# EAGLE design display_reva (EAGLE 7.7.0)
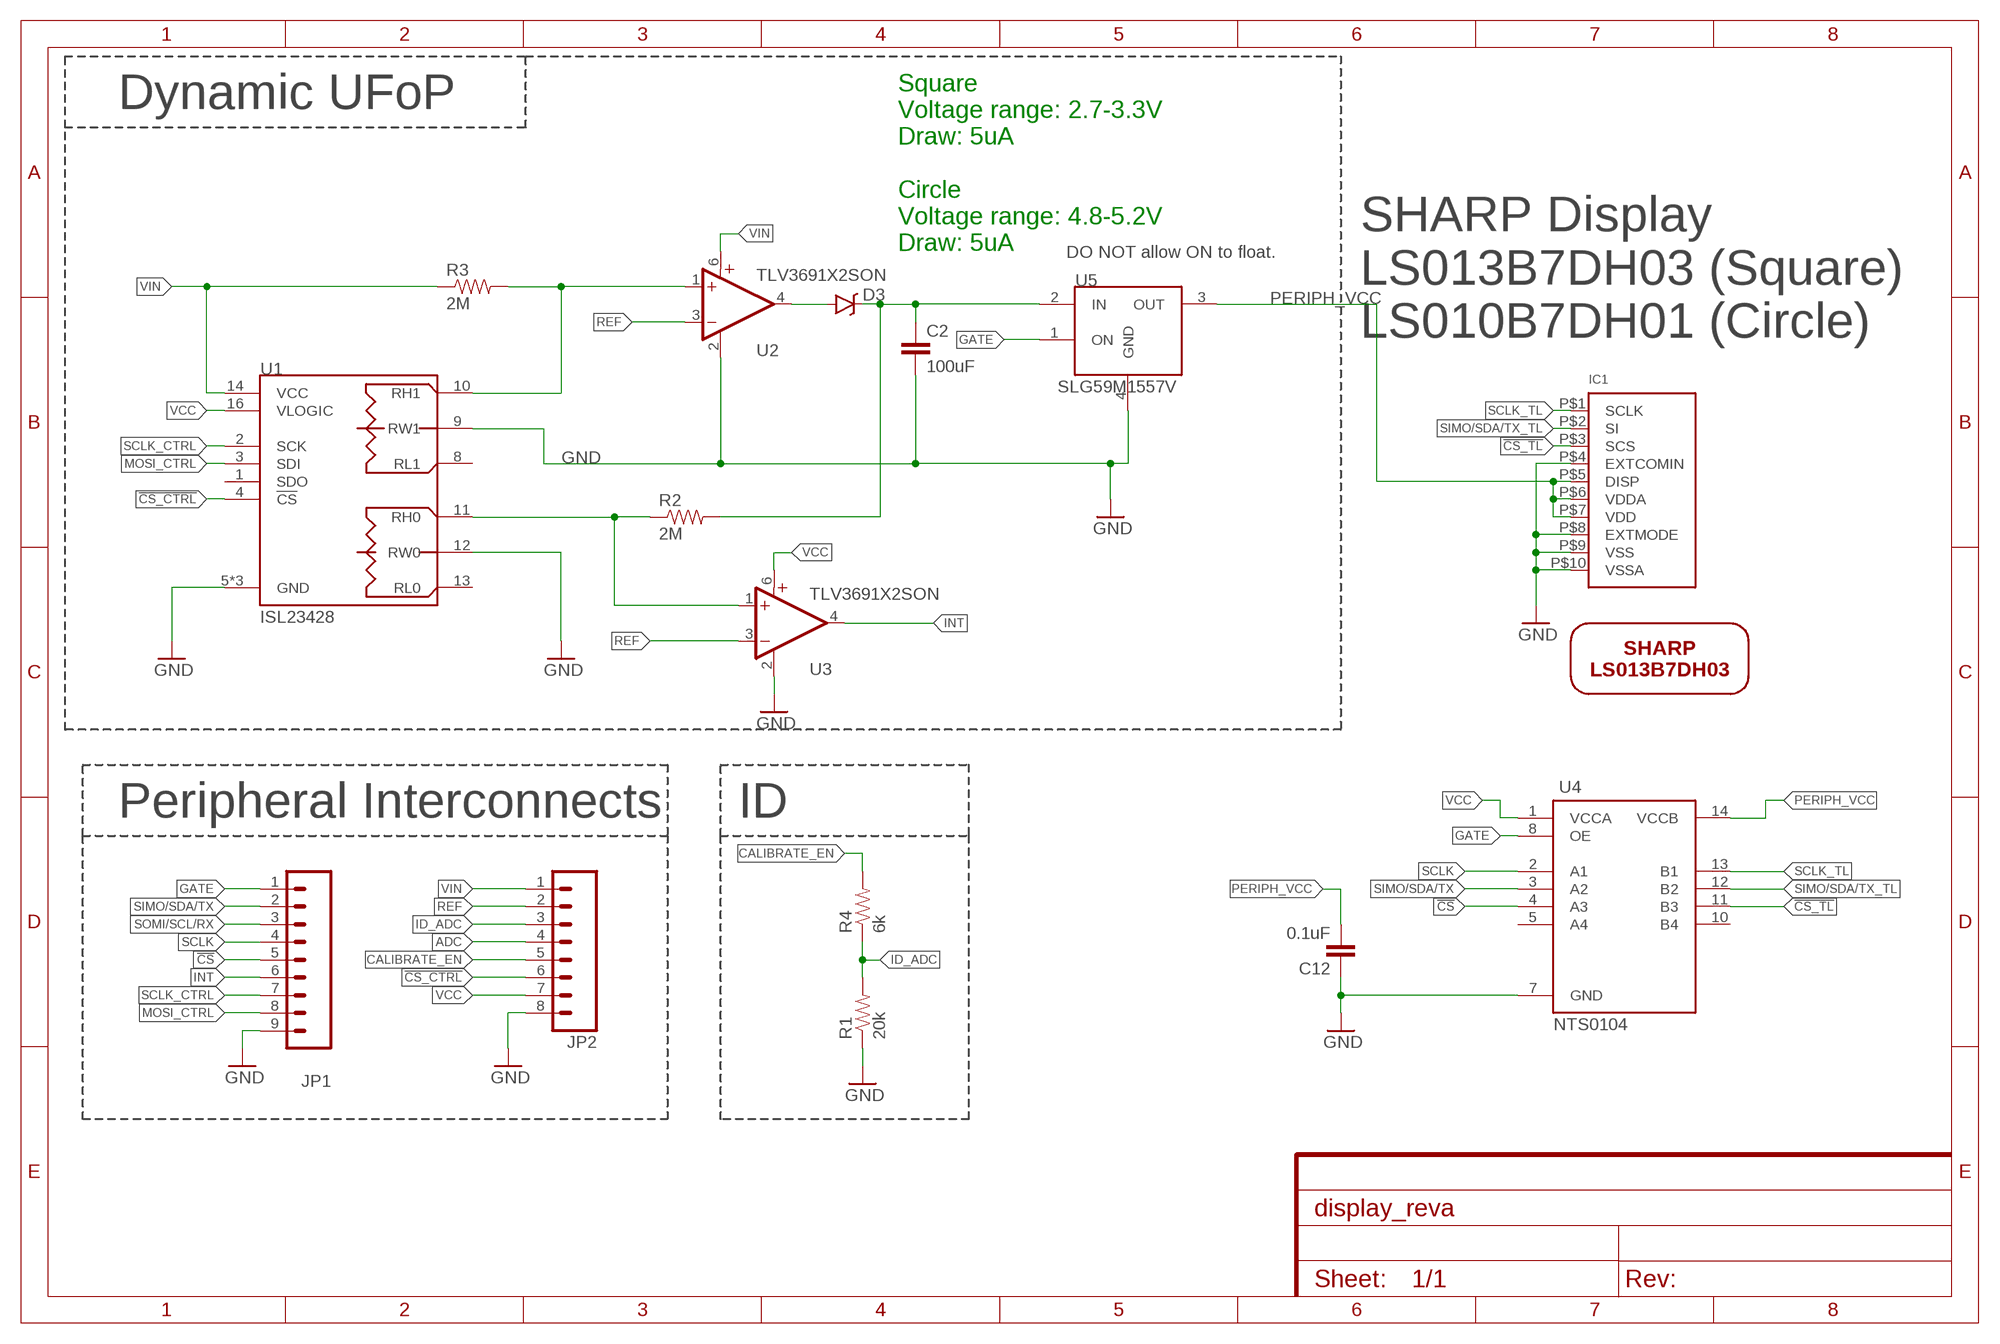
[diagram p0: schematic, sheet 1]
FRAME2 (FRAME-A4L): CNAME: Display Peripheral; CREVISION: A; DESIGNER: Josiah Hester

## Parts
C2  100uF  CAP1206  [1206]
C12  0.1uF  C-EU  [0402]
D3  RB751  DIODE-SCHOTTKY-RB751  [SOD-523]
IC1  SHARP_MEMORYLCD_10PIN  [FPC_10PIN_52892-1095]
JP1  M091.27MM  [1X09-1.27MM]
JP2  M081.27MM  [1X08-1.27MM]
R1  20k  R-EU  [0402]
R2  2M  R-EU  [0402]
R3  2M  R-EU  [0402]
R4  6k  R-EU  [0402]
U1  ISL23428  [UTQFN-16]
U2  TLV3691X2SON  [X2SON]
U3  TLV3691X2SON  [X2SON]
U4  NTS0104  [TSSOP14]
U5  SLG59M1557V  [4STDFN]
U$3  LS013B7DH03  [LS013B7DH03_HF]

## Nets
!CS: JP1.5 U4.4(A3)
!CS_CTRL: JP2.6 U1.4(!CS)
!CS_TL: IC1.P$3(SCS) U4.11(B3)
ADC: JP2.4
CALIBRATE_EN: JP2.5 R4.2
GATE: JP1.1 U4.8(OE) U5.1(ON)
GND: C2.2 C12.1 IC1.P$4(EXTCOMIN) IC1.P$8(EXTMODE) IC1.P$9(VSS) IC1.P$10(VSSA) JP1.9 JP2.8 R1.1 U1.5(GND) U1.6(GND) U1.9(RW1) U1.12(RW0) U1.15(GND) U2.2(GND) U3.2(GND) U4.7(GND) U5.4(GND)
ID_ADC: JP2.3 R1.2 R4.1
INT: JP1.6 U3.4(OUT)
MOSI_CTRL: JP1.8 U1.3(SDI)
N$1: D3.A U2.4(OUT)
N$2: C2.1 D3.C R2.2 U5.2(IN)
N$4: R3.2 U1.10(RH1) U2.1(+IN)
N$5: R2.1 U1.11(RH0) U3.1(+IN)
PERIPH_VCC: C12.2 IC1.P$5(DISP) IC1.P$6(VDDA) IC1.P$7(VDD) U4.14(VCCB) U5.3(OUT)
REF: JP2.2 U2.3(-IN) U3.3(-IN)
SCLK: JP1.4 U4.2(A1)
SCLK_CTRL: JP1.7 U1.2(SCK)
SCLK_TL: IC1.P$1(SCLK) U4.13(B1)
SIMO/SDA/TX: JP1.2 U4.3(A2)
SIMO/SDA/TX_TL: IC1.P$2(SI) U4.12(B2)
SOMI/SCL/RX: JP1.3
VCC: JP2.7 U1.16(VLOGIC) U3.6(V+) U4.1(VCCA)
VIN: JP2.1 R3.1 U1.14(VCC) U2.6(V+)
Unconnected: U1.1(SDO) U1.8(RL1) U1.13(RL0) U4.5(A4) U4.10(B4)

## Notes on the sheet
- Dynamic UFoP
- Square
  Voltage range: 2.7-3.3V
  Draw: 5uA
  
  Circle
  Voltage range: 4.8-5.2V
  Draw: 5uA
- DO NOT allow ON to float.
- SHARP Display
  LS013B7DH03 (Square)
  LS010B7DH01 (Circle)
- Peripheral Interconnects | ID

## Library data of the parts
C2 = SparkFun-Capacitors:CAP: Capacitor Standard 0603 ceramic capacitor, and 0.1" leaded capacitor.; DIGIKEY: 490-7217-1-ND; MPN: GRM31CR60J107ME39K
C12 = tiny_passives:C-EU; MPN: 0402YD104KAT2A
D3 = SparkFun-DiscreteSemi:DIODE-SCHOTTKY: Schottky diodes in SFE's production catalog BAT20J 1A 23V 0.62Vf RB751 120mA 40V 0.37Vf PMEG4005EJ 0.5A 40V 0.42Vf MBRA140 1A 40V 0.5Vf B340A 3A 40V SMA; DIGIKEY: BAS40-02V-V-G-08GICT-ND; MPN: BAS40-02V-V-G-08; PROD_ID: DIO-11018
IC1 = sharp_lcd:SHARP_MEMORYLCD_10PIN: Sharp Mono Memory LCD LS013B4DN02 - 1.35" 96x96 Pixels LS027B7DH01 - 2.7" 400x240 Pixels; DIGIKEY: WM11083CT-ND; MPN: 0528921033; PARTNUMBER: 0528921033
JP1 = SparkFun-Connectors:M09: Header 9 Standard 9-pin 0.1" header. Use with straight break away headers (SKU : PRT-00116), right angle break away headers (PRT-00553), swiss pins (PRT-00743), machine pins (PRT-00117), and female headers (PRT-00115).; DIGIKEY: S9014E-09-ND; MPN: GRPB091VWVN-RC
JP2 = SparkFun-Connectors:M08: Header 8 Standard 8-pin 0.1" header. Use with straight break away headers (SKU : PRT-00116), right angle break away headers (PRT-00553), swiss pins (PRT-00743), machine pins (PRT-00117), and female headers (PRT-00115).; DIGIKEY: S9014E-08-ND; MPN: GRPB081VWVN-RC
R1 = tiny_passives:R-EU; MPN: ERJ-2RKF2002X
R2 R3 = tiny_passives:R-EU; DIGIKEY: 1276-4293-1-ND; MPN: RC1005F205CS
R4 = tiny_passives:R-EU; MPN: RC0402FR-076K04L
U1 = isl23428:ISL23428: Intersil: Dual, 128-Tap, Low Voltage Digitally Controlled Potentiometer The ISL23428 is a volatile, low voltage, low noise, low power, 128-tap, dual digitally controlled potentiometer (DCP) with an SPI Bus™ interface. It integrates two DCP cores, wiper switches and control logic on a monolithic CMOS integrated circuit. Each digitally controlled potentiometer is implemented with a combination of resistor elements and CMOS switches. The position of the wipers are controlled by the user through the SPI bus interface. Each potentiometer has an associated volatile Wiper Register (WRi, i = 0, 1) that can be directly written to and read by the user. The contents of the WRi controls the position of the wiper. When powered on, the wiper of each DCP will always commence at mid-scale (64 tap position). The low voltage, low power consumption, and small package of the ISL23428 make it an ideal choice for use in battery operated equipment. In addition, the ISL23428 has a VLOGIC pin allowing down to 1.2V bus operation, independent from the VCC value. This allows for low logic levels to be connected directly to the ISL23428 without passing through a voltage level shifter. The DCP can be used as a three-terminal potentiometer or as a two-terminal variable resistor in a wide variety of applications including control, parameter adjustments, and signal processing; DIGIKEY: ISL23428TFRUZ-T7ACT-ND; MPN: ISL23428TFRUZ-T7A
U2 U3 = tlv3691:TLV3691: 0.9-V to 6.5-V, Nanopower Comparator Datasheets Analog Signal Chain Guide <http://www.ti.com/lit/pdf/slyb174> TLV3691 <http://www.ti.com/lit/ds/symlink/tlv3691.pdf> Manufacturer Product Page TLV3691IDPFR Specifications <http://www.ti.com/general/docs/suppproductinfo.tsp?distId=10&orderablePartNumber=TLV3691IDPFR> Standard Package <javascript:dlgHelp('Standard%20Packaging%20Help');> 1 Category Integrated Circuits (ICs) </product-search/en/integrated-circuits-ics> Family Linear - Comparators </product-search/en/integrated-circuits-ics/linear-comparators/2556221> Series - Packaging <javascript:dlgHelp('Standard%20Packaging%20Help');> Cut Tape (CT) <javascript:dlgHelp('Cut%20Tape%20Help');> Type General Purpose Number of Elements 1 Output Type Push-Pull Voltage - Supply, Single/Dual (±) 0.9 V ~ 6.5 V, ±0.45 V ~ 3.25 V Voltage - Input Offset (Max) 3mV Current - Input Bias (Max) 100pA Current - Output (Typ) 42mA Current - Quiescent (Max) 150nA CMRR, PSRR (Typ) - Propagation Delay (Max) 35µs Hysteresis - Operating Temperature -40°C ~ 125°C Package / Case 6-XFDFN Mounting Type Surface Mount Supplier Device Package 6-X2SON (1x1) Online Catalog Comparators - 1 element </catalog/en/partgroup/comparators-1-element/3112?mpart=TLV3691IDPFR&vendor=296&WT.z_ref_page_type=PS&WT.z_ref_page_sub_type=PD&WT.z_ref_page_id=PD&WT.z_ref_page_event=DC_Link_Table> Other Names 296-37242-1; DIGIKEY: 296-37242-1-ND; MPN: TLV3691IDPFR
U4 = nts0104:NTS0104: NXP: NTS0104 Dual supply translating transceiver; open drain; auto direction sensing The NTS0104 is a 4-bit, dual supply translating transceiver with auto direction sensing, that enables bidirectional voltage level translation. It features two 4-bit input-output ports (An and Bn), one output enable input (OE) and two supply pins (VCC(A) and VCC(B)). VCC(A) can be supplied at any voltage between 1.65 V and 3.6 V and VCC(B) can be supplied at any voltage between 2.3 V and 5.5 V, making the device suitable for translating between any of the voltage nodes (1.8 V, 2.5 V, 3.3 V and 5.0 V). Pins An and OE are referenced to VCC(A) and pins Bn are referenced to VCC(B). A LOW level at pin OE causes the outputs to assume a high-impedance OFF-state. This device is fully specified for partial power-down applications using IOFF. The IOFF circuitry disables the output, preventing the damaging backflow current through the device when it is powered down.; DIGIKEY: 568-8382-1-ND; MANUFACTURERPARTNUMBER: NTS0104PW,118; MPN: NTS0104PW,118; PARTNUMBER: NTS0104PW,118
U5 = loadswitches:SLG59M1557V: SILEGO SLG59M1557V: Ultra-small 28.5 mΩ, 1.0 A Integrated Power Switch with Discharge The SLG59M1557V is designed for load switching applications with ultra low quiescent current (20nA), and low turn on voltage (0.85V). The part comes with one 28.5 mΩ 1.0 A rated P-channel MOSFET controlled by a single ON control pin. The product is packaged in an ultra-small 1.0 x 1.0 mm package.; MOUSER: 402-SLG59M1557V; MPN: SLG59M1557V
U$3 = sharp_screens:LS013B7DH03: Sharp Microelectronics TFT Displays & Accessories 1.28" Memory LCD 128x128 Tranf HR-TFT; DIGIKEY: 425-2899-ND

## Board
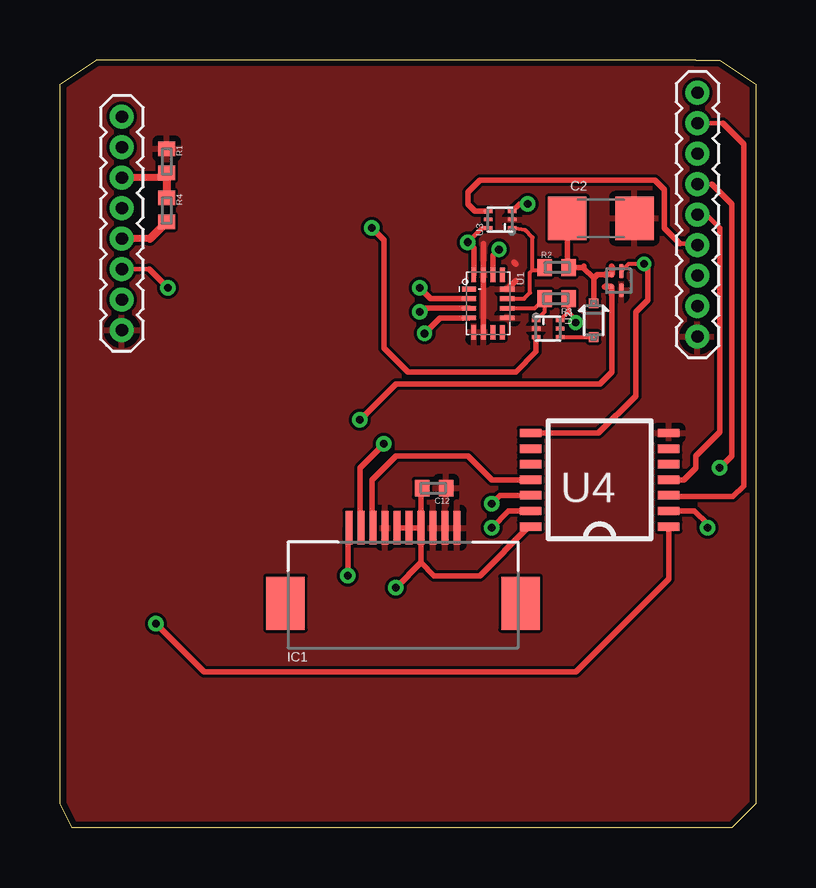
[diagram p1: board, top side]
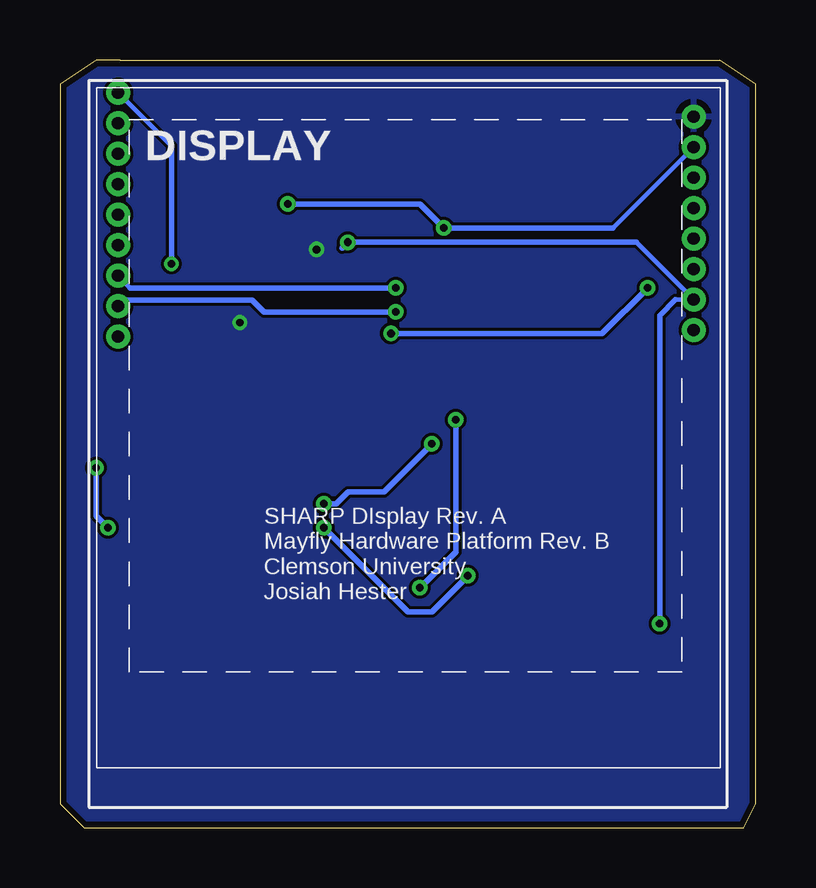
[diagram p2: board, bottom side, seen from below]

Size 29 x 32 mm. Coordinates in mm from the lower left corner, seen from the top.
Outline: 26.5,32 1.5,32 0,31 0,1 0.5,0 28,0 29,1 29,31 27.5,32 26.5,32
Copper layers (1*16): Top 0.035mm / dielectric 1.5mm / Bottom 0.035mm
Design rules "MF_Standard_2_Layer": minimum track width 5mil, minimum drill 12mil, track to track 5mil, track to pad 5mil, pad to pad 5mil, via to via 5mil, smd to smd 0mil, copper to edge 10mil, drill to drill 10mil, minimum pad ring 6mil, minimum via ring 6mil, stop-mask expansion 2mil, vias tented up to drill 25mil, thermal gap 10mil

### Footprints (pad centres in the part's own frame; a part is rotated, then mirrored left to right if it is on the bottom)
1206 = smd 1.6 x 1.8: 1 -1.4,0; 2 1.4,0
0402 = smd 0.6 x 0.7: 1 -0.5,0; 2 0.5,0
SOD-523 = smd 0.4 x 0.4: A -0.7,0; C 0.7,0
FPC_10PIN_52892-1095 = smd 0.3 x 1.4: P$1 -2.25,0; P$2 -1.75,0; P$3 -1.25,0; P$4 -0.75,0; P$5 -0.25,0; P$6 0.25,0; P$7 0.75,0; P$8 1.25,0; P$9 1.75,0; P$10 2.25,0 | smd 1.6 x 2.2: SUPPORT1 -4.9,-3.15; SUPPORT2 4.9,-3.15
1X09-1.27MM = drill 0.508 pad 1: 1 0,0; 2 1.27,0; 3 2.54,0; 4 3.81,0; 5 5.08,0; 6 6.35,0; 7 7.62,0; 8 8.89,0; 9 10.16,0
1X08-1.27MM = drill 0.508 pad 1: 1 0,0; 2 1.27,0; 3 2.54,0; 4 3.81,0; 5 5.08,0; 6 6.35,0; 7 7.62,0; 8 8.89,0
UTQFN-16 = smd 0.2 x 0.6: 1 -0.6,-0.8; 2 -0.2,-0.8; 3 0.2,-0.8; 4 0.6,-0.8; 9 0.6,0.8; 10 0.2,0.8; 11 -0.2,0.8; 12 -0.6,0.8 | smd 0.6 x 0.2: 5 1.2,-0.6; 6 1.2,-0.2; 7 1.2,0.2; 8 1.2,0.6; 13 -1.2,0.6; 14 -1.2,0.2; 15 -1.2,-0.2; 16 -1.2,-0.6
X2SON = smd 0.152 x 0.35: 1 -0.35,-0.5; 2 0,-0.5; 3 0.35,-0.5; 4 0.35,0.5; 5 0,0.5; 6 -0.35,0.5
TSSOP14 = smd 0.9 x 0.35: 1 -2.875,1.95; 2 -2.875,1.3; 3 -2.875,0.65; 4 -2.875,0; 5 -2.875,-0.65; 6 -2.875,-1.3; 7 -2.875,-1.95; 8 2.875,-1.95; 9 2.875,-1.3; 10 2.875,-0.65; 11 2.875,0; 12 2.875,0.65; 13 2.875,1.3; 14 2.875,1.95
4STDFN = smd 0.6 x 0.2: 1 -0.4,0.1; 4 0.4,0.1 | smd 0.152 x 0.152: 2 -0.25,-0.3; 3 0.25,-0.3

### Placement (x,y rotation side)
C2  22.55,25.4 0 top
C12  15.6,14.15 180 top
D3  22.25,21.15 90 top
IC1  14.3,12.5 0 top
JP1  26.58,30.63 270 top
JP2  2.58,29.63 270 top
R1  4.45,27.8 270 top
R2  20.7,23.35 0 top
R3  20.7,22.05 180 top
R4  4.45,25.75 270 top
U1  17.85,21.85 270 top
U2  20.35,20.8 270 top
U3  18.35,25.35 90 top
U4  22.5,14.5 180 top
U5  23.3,22.8 270 top
U$3  14.5,16 0 bottom

### Tracks (layer width: path | path; a pad name or v marks a point on that pad's centre or on a via)
!CS
  Top 0.19: 27.5,25 26.95,25.55 JP1.5
  Top 0.222: 27.5,25 27.5,16.5 26.5,15.5 26.5,15 26,14.5 U4.4
!CS_CTRL  (via drill 0.33)
  Top 0.19: 3.72,23.28 JP2.6
  Top 0.222: U1.4 15.85,21.25 v15.2,20.6 | v4.5,22.5 3.72,23.28
  Bottom 0.222: 2.6,23.3 JP2.6 | v15.2,20.6 6.4,20.6 v4.5,22.5
!CS_TL
  Top 0.222: U4.11 18,14.5 17,15.5 14,15.5 13,14.5 13,12.55 IC1.P$3
CALIBRATE_EN
  Top 0.3: 3.75,24.55 JP2.5
  Top 0.333: 3.75,24.55 R4.2
GATE  (via drill 0.3)
  Top 0.16: v24.35,23.5 23.7,23.5 U5.1
  Top 0.222: v24.35,23.5 24.5,23.35 24.5,22 24,21.5 24,18 22.45,16.45 U4.8
  Bottom 0.19: 24.35,28.4 JP1.1
  Bottom 0.222: 24.35,28.4 v24.35,23.5
GND
  Top 0.222: U1.6 U1.15 17.65,24.35 | U1.12 19,22.8 | 19,23.5 18.93,23.57
  pour Top: 31,-2.5 -2.5,-2.5 -2.5,32.5 31,32.5
ID_ADC
  Top 0.3: 4.45,27.09 JP2.3
  Top 0.333: R1.2 4.45,27.09 R4.1
INT
  Top 0.19: 25.85,24.35 26.51,24.35 JP1.6
  Top 0.222: U3.4 17.3,25.7 17,26 17,26.5 17.5,27 24.8,27 25.2,26.6 25.2,25 25.85,24.35
MOSI_CTRL  (via drill 0.33)
  Top 0.222: U1.3 15.15,21.65 v15,21.5
  Bottom 0.19: 26.32,22 JP1.8
  Bottom 0.222: v15,21.5 20.5,21.5 21,22 26.32,22
N$1
  Top 0.16: U2.4 D3.A
N$2
  Top 0.222: D3.C 22.25,22.9 | 22.25,22.9 22.4,23.05 U5.2 | 21.8,23.35 R2.2 21.15,23.4 C2.1 | 21.8,23.35 22.25,22.9 | 21.85,23.4 21.8,23.35
N$4
  Top 0.16: U2.1 20.2,21.5 R3.2 19.8,21.65 U1.10
N$5
  Top 0.16: U1.11 19.35,22.05 19.6,22.3 19.6,23.15 19.7,23.25 | 19.7,23.25 20.1,23.25 R2.1 | 19.7,23.25 19.7,24.6 19.4,24.9 U3.1
PERIPH_VCC  (via drill 0.33)
  Top 0.222: IC1.P$7 IC1.P$6 IC1.P$5 | IC1.P$7 15.05,14.1 C12.2 | 23,22.2 23,19 22.5,18.5 14,18.5 v12.5,17 | v14,10 15.05,11.05 | 15.05,11.05 IC1.P$7 | U4.14 19.55,12.55 17.5,10.5 15.6,10.5 15.05,11.05
  Bottom 0.222: v12.5,17 12.5,11.5 v14,10
REF  (via drill 0.33)
  Top 0.222: v13,25 13.5,24.5 13.5,20 14.5,19 19,19 19.85,19.85 U2.3 | U3.3 19.15,26 v19.5,26
  Bottom 0.19: 5.94,25 JP2.2
  Bottom 0.222: 5.94,25 v13,25 14,26 v19.5,26
SCLK  (via drill 0.33)
  Top 0.19: 27.18,26.82 JP1.4
  Top 0.222: 27.18,26.82 28,26 28,15.5 v27.5,15 | v27,12.5 27,12.65 26.45,13.2 U4.2
  Bottom 0.222: v27.5,15 27.5,13 v27,12.5
SCLK_CTRL  (via drill 0.33)
  Top 0.222: U1.2 15.45,22.05 v15,22.5
  Bottom 0.19: 26.07,22.5 JP1.7
  Bottom 0.222: v15,22.5 26.07,22.5
SCLK_TL  (via drill 0.33)
  Top 0.222: U4.13 18.7,13.2 v18,12.5 | v12,10.5 12,12.45 IC1.P$1
  Bottom 0.222: v18,12.5 14.5,9 13.5,9 v12,10.5
SIMO/SDA/TX
  Top 0.19: 27.64,29.36 JP1.2
  Top 0.222: 27.64,29.36 28.5,28.5 28.5,14.25 28.05,13.8 25.43,13.8 U4.3
SIMO/SDA/TX_TL  (via drill 0.33)
  Top 0.222: U4.12 18.35,13.85 v18,13.5 | v13.5,16 12.5,15 12.5,12.55 IC1.P$2
  Bottom 0.222: v18,13.5 17.5,13.5 17,14 15.5,14 v13.5,16
VCC  (via drill 0.33)
  Top 0.18: U3.6 17.6,25 v17,24.4
  Top 0.222: v17,24.4 17.25,24.15 U1.16 | U4.1 25.38,10.38 21.5,6.5 6,6.5 v4,8.5
  Bottom 0.19: 4.97,24.4 JP2.7 3.34,22.01
  Bottom 0.222: 17.25,24.15 v17,24.4 4.97,24.4 | v4,8.5 4,21.35 3.34,22.01
VIN  (via drill 0.3, 0.33)
  Top 0.16: R3.1 21.2,21.5 | 21.2,21.5 U2.6 | v21.5,21.05 21.5,21.2 21.2,21.5
  Top 0.222: U1.14 18.05,23.85 v18.3,24.1
  pour Bottom: 30.5,-2 -2.5,-2.5 -2.5,32.5 31,32.5

### Text on the board
bPlace: SHARP DIsplay Rev. A / Mayfly Hardware Platform Rev. B / Clemson University / Josiah Hester